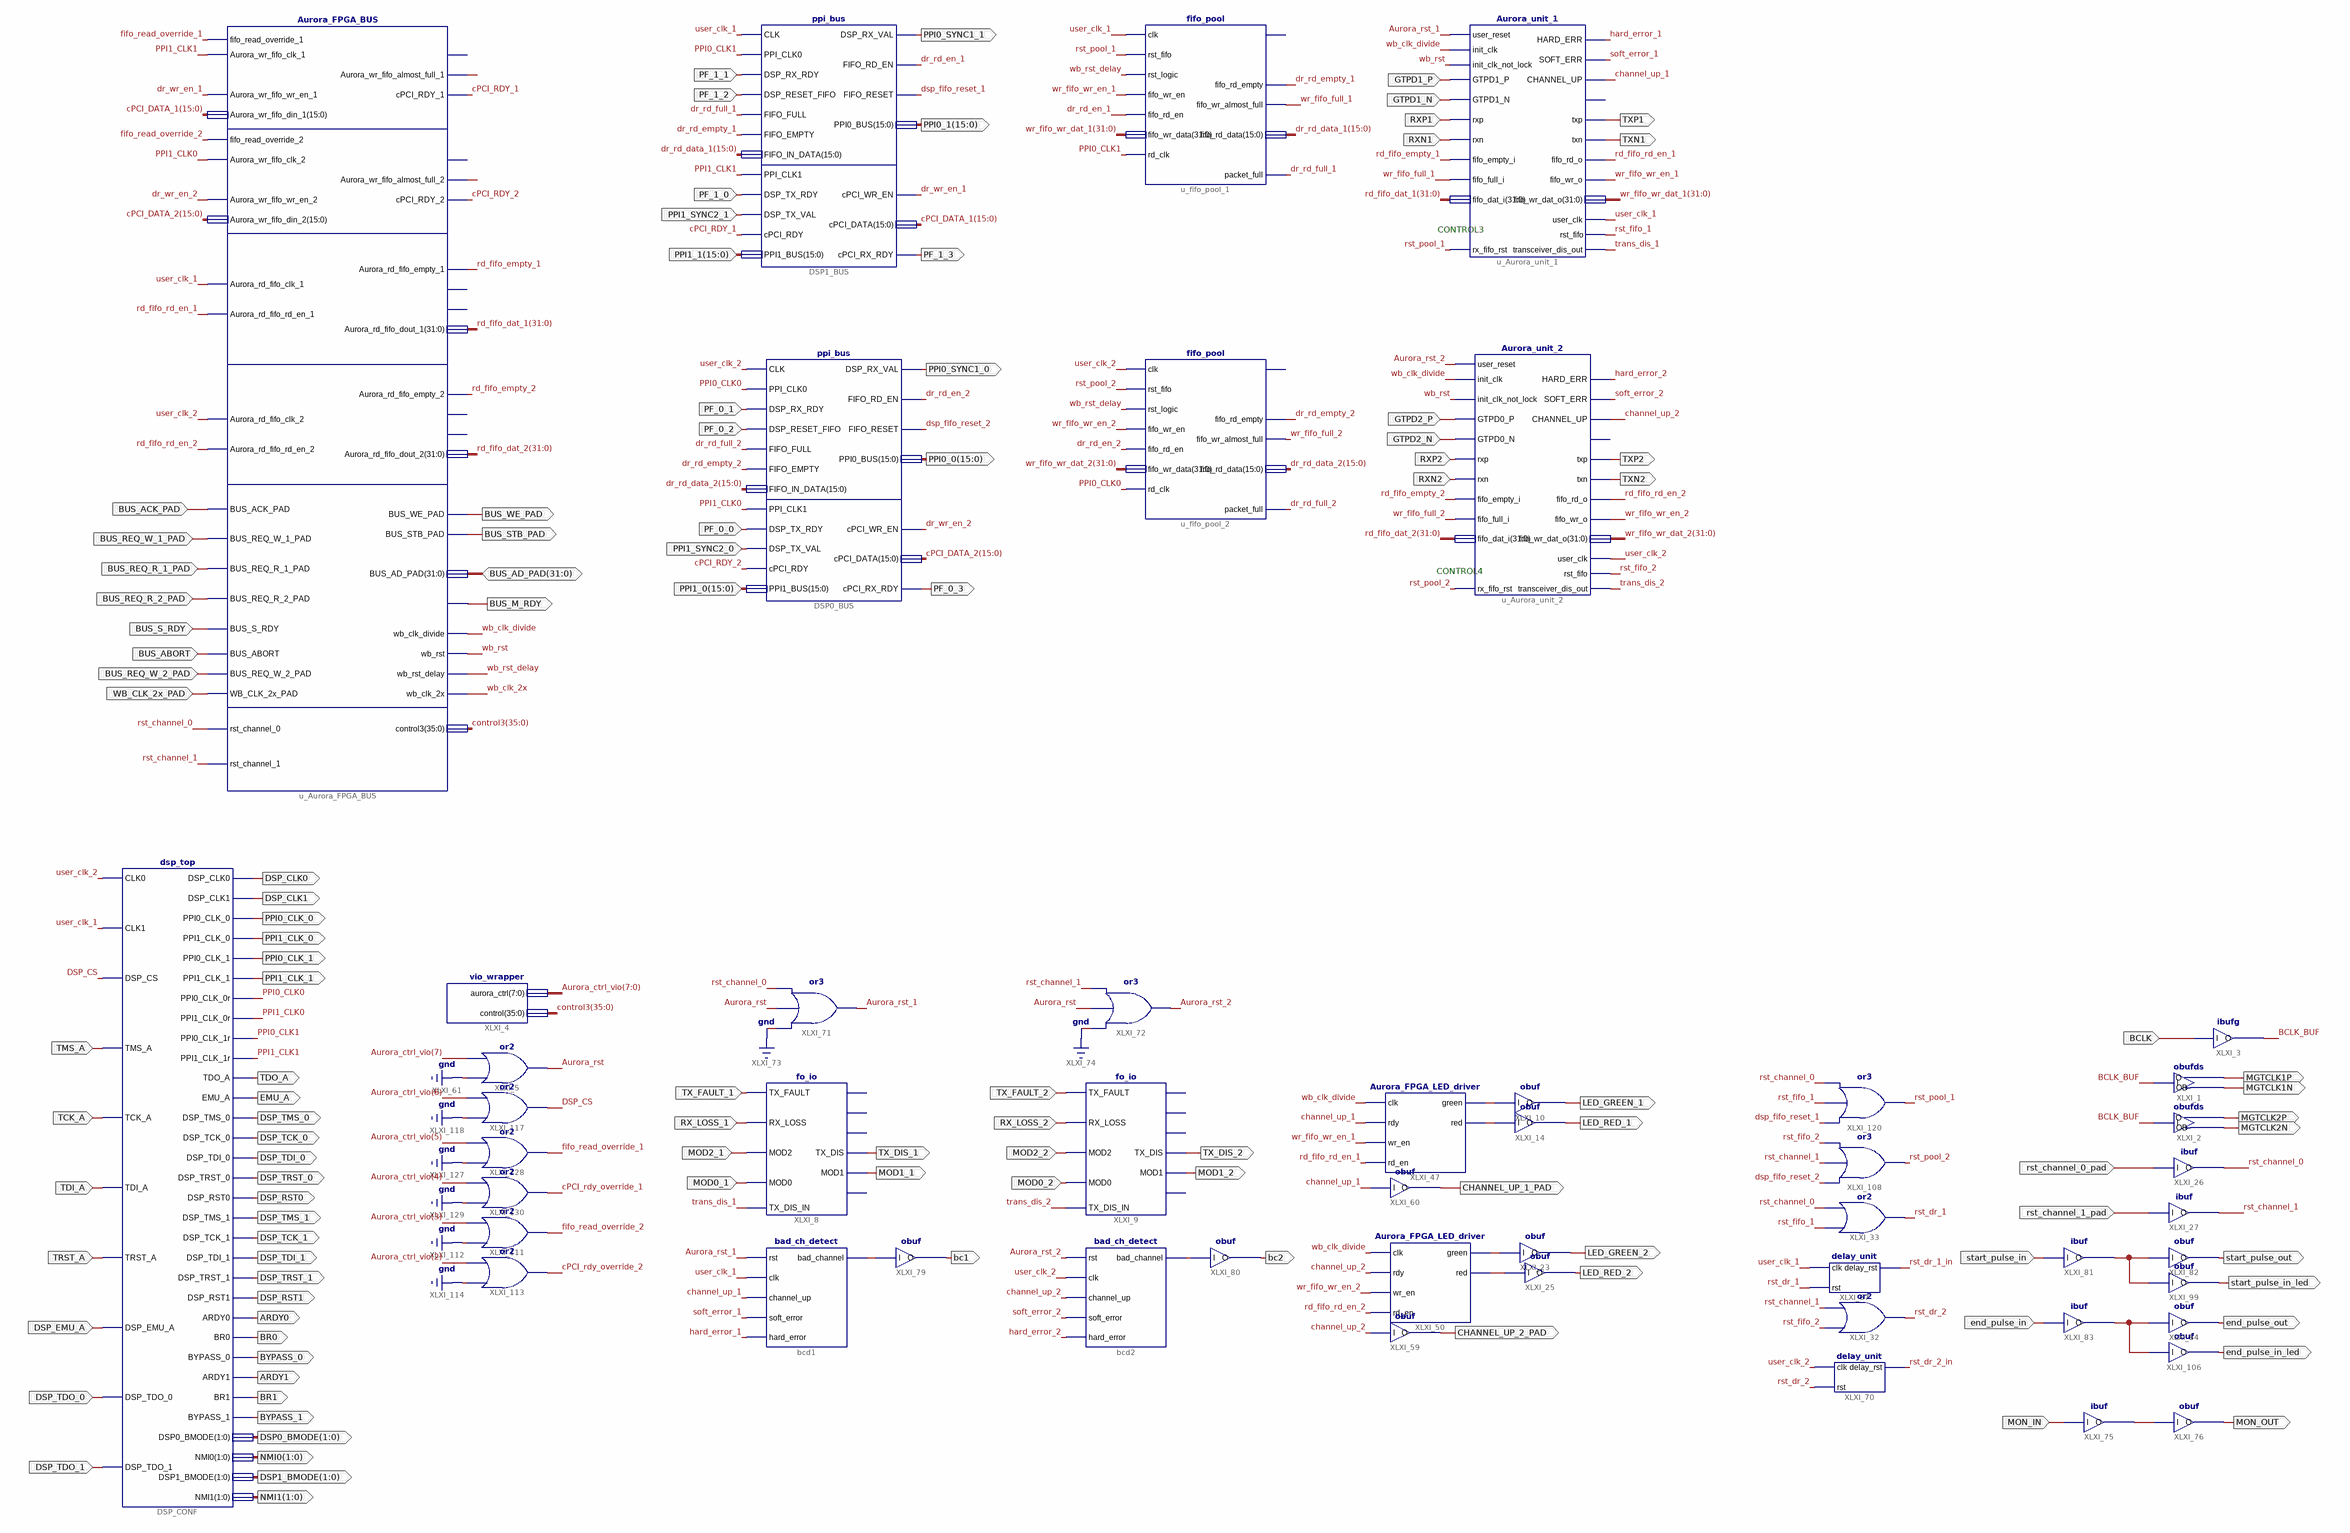
[diagram p0: schematic sheet 1]
// Xilinx ISE schematic Aurora_FPGA.sch (spartan6) as structural Verilog: 50 symbols, 110 ports
module Aurora_FPGA (
  input  BUS_REQ_W_2_PAD,
  input  BUS_ABORT,
  input  BUS_S_RDY,
  input  WB_CLK_2x_PAD,
  input  BUS_REQ_R_2_PAD,
  input  BUS_REQ_R_1_PAD,
  input  BUS_REQ_W_1_PAD,
  input  BUS_ACK_PAD,
  input  PF_1_1,
  input  PF_1_2,
  input  PF_1_0,
  input  PPI1_SYNC2_1,
  input  [15:0] PPI1_1,
  input  GTPD1_P,
  input  GTPD1_N,
  input  RXP1,
  input  RXN1,
  input  PF_0_1,
  input  PF_0_2,
  input  [15:0] PPI1_0,
  input  PPI1_SYNC2_0,
  input  PF_0_0,
  input  GTPD2_P,
  input  GTPD2_N,
  input  RXP2,
  input  RXN2,
  input  end_pulse_in,
  input  start_pulse_in,
  input  rst_channel_1_pad,
  input  rst_channel_0_pad,
  input  BCLK,
  input  TX_FAULT_1,
  input  RX_LOSS_1,
  input  MOD2_1,
  input  MOD0_1,
  input  TX_FAULT_2,
  input  RX_LOSS_2,
  input  MOD2_2,
  input  MOD0_2,
  input  MON_IN,
  input  TMS_A,
  input  TCK_A,
  input  TDI_A,
  input  TRST_A,
  input  DSP_EMU_A,
  input  DSP_TDO_0,
  input  DSP_TDO_1,
  inout  [31:0] BUS_AD_PAD,
  output BUS_M_RDY,
  output BUS_STB_PAD,
  output BUS_WE_PAD,
  output PF_1_3,
  output [15:0] PPI0_1,
  output PPI0_SYNC1_1,
  output TXP1,
  output TXN1,
  output PPI0_SYNC1_0,
  output [15:0] PPI0_0,
  output PF_0_3,
  output TXP2,
  output TXN2,
  output end_pulse_in_led,
  output end_pulse_out,
  output start_pulse_in_led,
  output start_pulse_out,
  output MGTCLK1P,
  output MGTCLK1N,
  output MGTCLK2P,
  output MGTCLK2N,
  output LED_GREEN_2,
  output LED_RED_2,
  output CHANNEL_UP_2_PAD,
  output LED_GREEN_1,
  output LED_RED_1,
  output CHANNEL_UP_1_PAD,
  output bc1,
  output TX_DIS_1,
  output MOD1_1,
  output bc2,
  output TX_DIS_2,
  output MOD1_2,
  output MON_OUT,
  output PPI1_CLK_1,
  output PPI0_CLK_1,
  output PPI1_CLK_0,
  output PPI0_CLK_0,
  output DSP_CLK1,
  output DSP_CLK0,
  output TDO_A,
  output EMU_A,
  output DSP_TMS_0,
  output DSP_TCK_0,
  output DSP_TDI_0,
  output DSP_TRST_0,
  output DSP_RST0,
  output DSP_TMS_1,
  output DSP_TCK_1,
  output DSP_TDI_1,
  output DSP_TRST_1,
  output DSP_RST1,
  output ARDY0,
  output BR0,
  output BYPASS_0,
  output ARDY1,
  output BR1,
  output BYPASS_1,
  output [1:0] DSP0_BMODE,
  output [1:0] NMI0,
  output [1:0] DSP1_BMODE,
  output [1:0] NMI1
);

  wire Aurora_rst, Aurora_rst_1, Aurora_rst_2, BCLK_BUF, channel_up_1, channel_up_2, cPCI_RDY_1, cPCI_RDY_2,
       cPCI_rdy_override_1, cPCI_rdy_override_2, dr_full_1, dr_full_2, dr_rd_empty_1, dr_rd_empty_2,
       dr_rd_en_1, dr_rd_en_2, dr_rd_full_1, dr_rd_full_2, dr_wr_en_1, dr_wr_en_2, DSP_CS, dsp_fifo_reset_1,
       dsp_fifo_reset_2, fifo_read_override_1, fifo_read_override_2, hard_error_1, hard_error_2, PPI0_CLK0,
       PPI0_CLK1, PPI1_CLK0, PPI1_CLK1, rd_fifo_empty_1, rd_fifo_empty_2, rd_fifo_rd_en_1, rd_fifo_rd_en_2,
       rst_channel_0, rst_channel_1, rst_dr_1, rst_dr_1_in, rst_dr_2, rst_dr_2_in, rst_fifo_1, rst_fifo_2,
       rst_pool_1, rst_pool_2, soft_error_1, soft_error_2, trans_dis_1, trans_dis_2, user_clk_1, user_clk_2,
       wb_clk_2x, wb_clk_divide, wb_rst, wb_rst_delay, wr_fifo_full_1, wr_fifo_full_2, wr_fifo_wr_en_1,
       wr_fifo_wr_en_2, XLXN_41, XLXN_53, XLXN_93, XLXN_149, XLXN_159, XLXN_191, XLXN_193, XLXN_223, XLXN_233;
  wire [7:0] Aurora_ctrl_vio;
  wire [15:0] cPCI_DATA_1, cPCI_DATA_2, dr_rd_data_1, dr_rd_data_2;
  wire [31:0] rd_fifo_dat_1, rd_fifo_dat_2, wr_fifo_wr_dat_1, wr_fifo_wr_dat_2;
  wire [35:0] control3;

  Aurora_FPGA_BUS u_Aurora_FPGA_BUS (
    .WB_CLK_2x_PAD(WB_CLK_2x_PAD), .Aurora_rd_fifo_rd_en_1(rd_fifo_rd_en_1),
    .Aurora_wr_fifo_clk_1(PPI1_CLK1), .Aurora_wr_fifo_wr_en_1(dr_wr_en_1),
    .Aurora_wr_fifo_din_1(cPCI_DATA_1), .Aurora_wr_fifo_clk_2(PPI1_CLK0), .BUS_ACK_PAD(BUS_ACK_PAD),
    .BUS_REQ_W_1_PAD(BUS_REQ_W_1_PAD), .BUS_REQ_R_1_PAD(BUS_REQ_R_1_PAD), .BUS_REQ_R_2_PAD(BUS_REQ_R_2_PAD),
    .BUS_S_RDY(BUS_S_RDY), .BUS_ABORT(BUS_ABORT), .BUS_REQ_W_2_PAD(BUS_REQ_W_2_PAD),
    .Aurora_wr_fifo_wr_en_2(dr_wr_en_2), .Aurora_rd_fifo_rd_en_2(rd_fifo_rd_en_2),
    .Aurora_wr_fifo_din_2(cPCI_DATA_2), .Aurora_rd_fifo_clk_1(user_clk_1), .Aurora_rd_fifo_clk_2(user_clk_2),
    .rst_channel_0(rst_channel_0), .rst_channel_1(rst_channel_1),
    .fifo_read_override_1(fifo_read_override_1), .fifo_read_override_2(fifo_read_override_2),
    .BUS_AD_PAD(BUS_AD_PAD), .control3(control3), .wb_clk_2x(wb_clk_2x), .wb_rst_delay(wb_rst_delay),
    .wb_rst(wb_rst), .wb_clk_divide(wb_clk_divide), .Aurora_rd_fifo_dout_1(rd_fifo_dat_1),
    .Aurora_rd_fifo_empty_1(rd_fifo_empty_1), .Aurora_wr_fifo_almost_full_1(dr_full_1),
    .Aurora_wr_fifo_almost_full_2(dr_full_2), .BUS_WE_PAD(BUS_WE_PAD), .BUS_STB_PAD(BUS_STB_PAD),
    .BUS_M_RDY(BUS_M_RDY), .Aurora_rd_fifo_dout_2(rd_fifo_dat_2), .Aurora_rd_fifo_empty_2(rd_fifo_empty_2),
    .cPCI_RDY_1(cPCI_RDY_1), .cPCI_RDY_2(cPCI_RDY_2));  // open: Aurora_wr_fifo_full_1, Aurora_wr_fifo_full_2, Aurora_rd_fifo_almost_empty_1, Aurora_rd_fifo_prog_empty_1, Aurora_rd_fifo_almost_empty_2, Aurora_rd_fifo_prog_empty_2
  ppi_bus DSP1_BUS (
    .CLK(user_clk_1), .PPI_CLK0(PPI0_CLK1), .PPI_CLK1(PPI1_CLK1), .DSP_RX_RDY(PF_1_1),
    .DSP_RESET_FIFO(PF_1_2), .FIFO_FULL(dr_rd_full_1), .FIFO_EMPTY(dr_rd_empty_1), .DSP_TX_RDY(PF_1_0),
    .DSP_TX_VAL(PPI1_SYNC2_1), .cPCI_RDY(cPCI_RDY_1), .FIFO_IN_DATA(dr_rd_data_1), .PPI1_BUS(PPI1_1),
    .DSP_RX_VAL(PPI0_SYNC1_1), .FIFO_RD_EN(dr_rd_en_1), .FIFO_RESET(dsp_fifo_reset_1), .cPCI_RX_RDY(PF_1_3),
    .cPCI_WR_EN(dr_wr_en_1), .PPI0_BUS(PPI0_1), .cPCI_DATA(cPCI_DATA_1));
  fifo_pool u_fifo_pool_1 (
    .clk(user_clk_1), .rd_clk(PPI0_CLK1), .rst_fifo(rst_pool_1), .rst_logic(wb_rst_delay),
    .fifo_wr_en(wr_fifo_wr_en_1), .fifo_rd_en(dr_rd_en_1), .fifo_wr_data(wr_fifo_wr_dat_1),
    .fifo_wr_almost_full(wr_fifo_full_1), .fifo_rd_empty(dr_rd_empty_1), .fifo_rd_data(dr_rd_data_1),
    .packet_full(dr_rd_full_1));  // open: fifo_wr_full
  Aurora_unit_1 u_Aurora_unit_1 (
    .init_clk(wb_clk_divide), .init_clk_not_lock(wb_rst), .user_reset(Aurora_rst_1), .GTPD1_P(GTPD1_P),
    .GTPD1_N(GTPD1_N), .rxp(RXP1), .rxn(RXN1), .fifo_empty_i(rd_fifo_empty_1), .fifo_full_i(wr_fifo_full_1),
    .fifo_dat_i(rd_fifo_dat_1), .HARD_ERR(hard_error_1), .SOFT_ERR(soft_error_1), .CHANNEL_UP(channel_up_1),
    .txp(TXP1), .txn(TXN1), .fifo_rd_o(rd_fifo_rd_en_1), .fifo_wr_o(wr_fifo_wr_en_1), .user_clk(user_clk_1),
    .transceiver_dis_out(trans_dis_1), .rst_fifo(rst_fifo_1), .fifo_wr_dat_o(wr_fifo_wr_dat_1),
    .rx_fifo_rst(rst_pool_1));  // open: LANE_UP
  ppi_bus DSP0_BUS (
    .CLK(user_clk_2), .PPI_CLK0(PPI0_CLK0), .PPI_CLK1(PPI1_CLK0), .DSP_RX_RDY(PF_0_1),
    .DSP_RESET_FIFO(PF_0_2), .FIFO_FULL(dr_rd_full_2), .FIFO_EMPTY(dr_rd_empty_2), .DSP_TX_RDY(PF_0_0),
    .DSP_TX_VAL(PPI1_SYNC2_0), .cPCI_RDY(cPCI_RDY_2), .FIFO_IN_DATA(dr_rd_data_2), .PPI1_BUS(PPI1_0),
    .DSP_RX_VAL(PPI0_SYNC1_0), .FIFO_RD_EN(dr_rd_en_2), .FIFO_RESET(dsp_fifo_reset_2), .cPCI_RX_RDY(PF_0_3),
    .cPCI_WR_EN(dr_wr_en_2), .PPI0_BUS(PPI0_0), .cPCI_DATA(cPCI_DATA_2));
  Aurora_unit_2 u_Aurora_unit_2 (
    .init_clk(wb_clk_divide), .init_clk_not_lock(wb_rst), .user_reset(Aurora_rst_2), .GTPD0_P(GTPD2_P),
    .GTPD0_N(GTPD2_N), .rxp(RXP2), .rxn(RXN2), .fifo_empty_i(rd_fifo_empty_2), .fifo_full_i(wr_fifo_full_2),
    .fifo_dat_i(rd_fifo_dat_2), .HARD_ERR(hard_error_2), .SOFT_ERR(soft_error_2), .CHANNEL_UP(channel_up_2),
    .txp(TXP2), .txn(TXN2), .fifo_rd_o(rd_fifo_rd_en_2), .fifo_wr_o(wr_fifo_wr_en_2), .user_clk(user_clk_2),
    .transceiver_dis_out(trans_dis_2), .rst_fifo(rst_fifo_2), .fifo_wr_dat_o(wr_fifo_wr_dat_2),
    .rx_fifo_rst(rst_pool_2));  // open: LANE_UP
  or XLXI_5 (Aurora_rst, 1'b0, Aurora_ctrl_vio[7]);
  vio_wrapper XLXI_4 (.control(control3), .aurora_ctrl(Aurora_ctrl_vio));
  or XLXI_117 (DSP_CS, 1'b0, Aurora_ctrl_vio[6]);
  or XLXI_111 (fifo_read_override_2, 1'b0, Aurora_ctrl_vio[3]);
  or XLXI_113 (cPCI_rdy_override_2, 1'b0, Aurora_ctrl_vio[2]);
  or XLXI_128 (fifo_read_override_1, 1'b0, Aurora_ctrl_vio[5]);
  or XLXI_130 (cPCI_rdy_override_1, 1'b0, Aurora_ctrl_vio[4]);
  fifo_pool u_fifo_pool_2 (
    .clk(user_clk_2), .rd_clk(PPI0_CLK0), .rst_fifo(rst_pool_2), .rst_logic(wb_rst_delay),
    .fifo_wr_en(wr_fifo_wr_en_2), .fifo_rd_en(dr_rd_en_2), .fifo_wr_data(wr_fifo_wr_dat_2),
    .fifo_wr_almost_full(wr_fifo_full_2), .fifo_rd_empty(dr_rd_empty_2), .fifo_rd_data(dr_rd_data_2),
    .packet_full(dr_rd_full_2));  // open: fifo_wr_full
  obuf XLXI_106 (.I(XLXN_233), .O(end_pulse_in_led));
  obuf XLXI_84 (.I(XLXN_233), .O(end_pulse_out));
  ibuf XLXI_83 (.I(end_pulse_in), .O(XLXN_233));
  obuf XLXI_99 (.I(XLXN_223), .O(start_pulse_in_led));
  obuf XLXI_82 (.I(XLXN_223), .O(start_pulse_out));
  ibuf XLXI_81 (.I(start_pulse_in), .O(XLXN_223));
  ibuf XLXI_27 (.I(rst_channel_1_pad), .O(rst_channel_1));
  ibuf XLXI_26 (.I(rst_channel_0_pad), .O(rst_channel_0));
  or XLXI_33 (rst_dr_1, rst_fifo_1, rst_channel_0);
  delay_unit XLXI_67 (.clk(user_clk_1), .rst(rst_dr_1), .delay_rst(rst_dr_1_in));
  or XLXI_32 (rst_dr_2, rst_fifo_2, rst_channel_1);
  delay_unit XLXI_70 (.clk(user_clk_2), .rst(rst_dr_2), .delay_rst(rst_dr_2_in));
  obufds XLXI_1 (.I(BCLK_BUF), .O(MGTCLK1P), .OB(MGTCLK1N));
  obufds XLXI_2 (.I(BCLK_BUF), .O(MGTCLK2P), .OB(MGTCLK2N));
  ibufg XLXI_3 (.I(BCLK), .O(BCLK_BUF));
  Aurora_FPGA_LED_driver XLXI_50 (
    .clk(wb_clk_divide), .rdy(channel_up_2), .wr_en(wr_fifo_wr_en_2), .rd_en(rd_fifo_rd_en_2),
    .green(XLXN_149), .red(XLXN_53));
  obuf XLXI_23 (.I(XLXN_149), .O(LED_GREEN_2));
  obuf XLXI_25 (.I(XLXN_53), .O(LED_RED_2));
  obuf XLXI_59 (.I(channel_up_2), .O(CHANNEL_UP_2_PAD));
  Aurora_FPGA_LED_driver XLXI_47 (
    .clk(wb_clk_divide), .rdy(channel_up_1), .wr_en(wr_fifo_wr_en_1), .rd_en(rd_fifo_rd_en_1),
    .green(XLXN_93), .red(XLXN_41));
  obuf XLXI_10 (.I(XLXN_93), .O(LED_GREEN_1));
  obuf XLXI_14 (.I(XLXN_41), .O(LED_RED_1));
  obuf XLXI_60 (.I(channel_up_1), .O(CHANNEL_UP_1_PAD));
  obuf XLXI_79 (.I(XLXN_193), .O(bc1));
  bad_ch_detect bcd1 (
    .rst(Aurora_rst_1), .clk(user_clk_1), .channel_up(channel_up_1), .soft_error(soft_error_1),
    .hard_error(hard_error_1), .bad_channel(XLXN_193));
  fo_io XLXI_8 (
    .TX_FAULT(TX_FAULT_1), .RX_LOSS(RX_LOSS_1), .MOD2(MOD2_1), .MOD0(MOD0_1), .TX_DIS(TX_DIS_1),
    .MOD1(MOD1_1), .TX_DIS_IN(trans_dis_1));  // open: xTX_FAULT, xMOD2, xMOD0, xRX_LOSS_N
  obuf XLXI_80 (.I(XLXN_191), .O(bc2));
  bad_ch_detect bcd2 (
    .rst(Aurora_rst_2), .clk(user_clk_2), .channel_up(channel_up_2), .soft_error(soft_error_2),
    .hard_error(hard_error_2), .bad_channel(XLXN_191));
  fo_io XLXI_9 (
    .TX_FAULT(TX_FAULT_2), .RX_LOSS(RX_LOSS_2), .MOD2(MOD2_2), .MOD0(MOD0_2), .TX_DIS(TX_DIS_2),
    .MOD1(MOD1_2), .TX_DIS_IN(trans_dis_2));  // open: xTX_FAULT, xMOD2, xMOD0, xRX_LOSS_N
  or XLXI_72 (Aurora_rst_2, 1'b0, Aurora_rst, rst_channel_1);
  or XLXI_71 (Aurora_rst_1, 1'b0, Aurora_rst, rst_channel_0);
  or XLXI_108 (rst_pool_2, dsp_fifo_reset_2, rst_channel_1, rst_fifo_2);
  or XLXI_120 (rst_pool_1, dsp_fifo_reset_1, rst_fifo_1, rst_channel_0);
  ibuf XLXI_75 (.I(MON_IN), .O(XLXN_159));
  obuf XLXI_76 (.I(XLXN_159), .O(MON_OUT));
  dsp_top DSP_CONF (
    .CLK0(user_clk_2), .CLK1(user_clk_1), .DSP_CS(DSP_CS), .TMS_A(TMS_A), .TCK_A(TCK_A), .TDI_A(TDI_A),
    .TRST_A(TRST_A), .DSP_EMU_A(DSP_EMU_A), .DSP_TDO_0(DSP_TDO_0), .DSP_TDO_1(DSP_TDO_1),
    .DSP_CLK0(DSP_CLK0), .DSP_CLK1(DSP_CLK1), .PPI0_CLK_0(PPI0_CLK_0), .PPI1_CLK_0(PPI1_CLK_0),
    .PPI0_CLK_1(PPI0_CLK_1), .PPI1_CLK_1(PPI1_CLK_1), .PPI0_CLK_0r(PPI0_CLK0), .PPI1_CLK_0r(PPI1_CLK0),
    .PPI0_CLK_1r(PPI0_CLK1), .PPI1_CLK_1r(PPI1_CLK1), .TDO_A(TDO_A), .EMU_A(EMU_A), .DSP_TMS_0(DSP_TMS_0),
    .DSP_TCK_0(DSP_TCK_0), .DSP_TDI_0(DSP_TDI_0), .DSP_TRST_0(DSP_TRST_0), .DSP_RST0(DSP_RST0),
    .DSP_TMS_1(DSP_TMS_1), .DSP_TCK_1(DSP_TCK_1), .DSP_TDI_1(DSP_TDI_1), .DSP_TRST_1(DSP_TRST_1),
    .DSP_RST1(DSP_RST1), .ARDY0(ARDY0), .BR0(BR0), .BYPASS_0(BYPASS_0), .ARDY1(ARDY1), .BR1(BR1),
    .BYPASS_1(BYPASS_1), .DSP0_BMODE(DSP0_BMODE), .NMI0(NMI0), .DSP1_BMODE(DSP1_BMODE), .NMI1(NMI1));

  // Notes on the sheet:
  //   CONTROL3
  //   CONTROL4
endmodule
